# EAGLE design OV2640 (EAGLE 9.2.2)
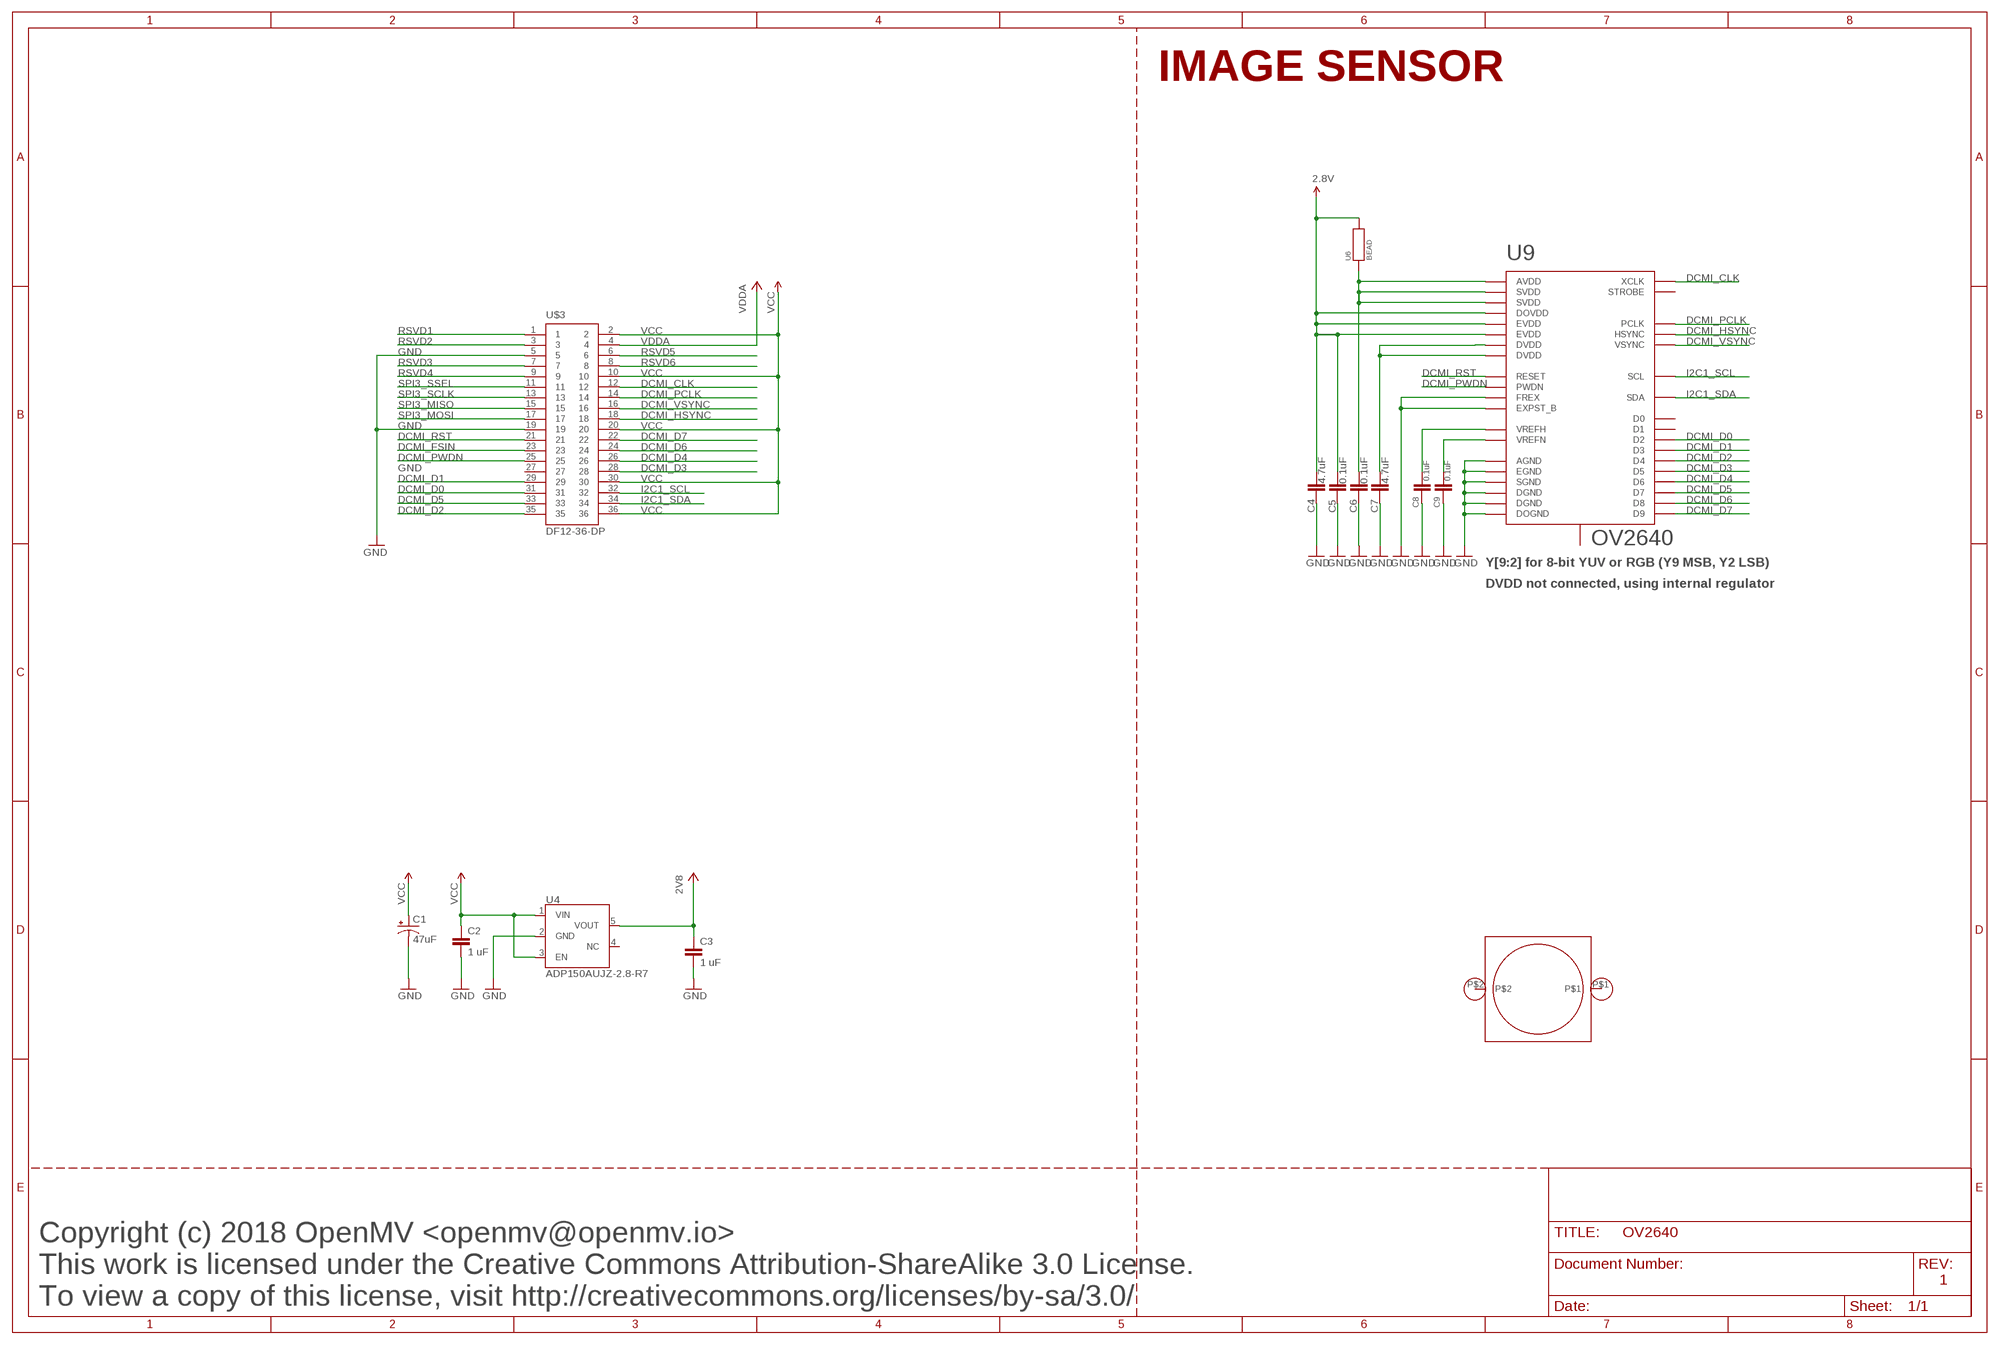
[diagram p0: schematic, sheet 1]

## Parts
C1  47uF  CAP_POL1206  [EIA3216]
C2  1 uF  CAP0402-CAP  [0402-CAP]
C3  1 uF  CAP0402-CAP  [0402-CAP]
C4  4.7uF  CAP0402-CAP  [0402-CAP]
C5  0.1uF  CAP0402-CAP  [0402-CAP]
C6  0.1uF  CAP0402-CAP  [0402-CAP]
C7  4.7uF  CAP0402-CAP  [0402-CAP]
C8  0.1uF  CAP0402-CAP  [0402-CAP]
C9  0.1uF  CAP0402-CAP  [0402-CAP]
LM1  LENSMOUNT20MM  [LENSMOUNT-20MM]
U4  ADP150AUJZ-2.8-R7  ADP150TSOT-5  [SOT23-5]
U6  BEAD  [0402-CAP]
U9  OV2640  [CSP2]
U$3  DF12-36-DP  [DF12-36-DP]

## Nets
2.8V: C4.1 C5.1 U6.2 U9.B1(DOVDD) U9.F1(EVDD) U9.G1(EVDD)
2V8: C3.1 U4.5(VOUT)
DCMI_CLK: U9.C4(XCLK) U$3.12
DCMI_D0: U9.F3(D2) U$3.31
DCMI_D1: U9.G3(D3) U$3.29
DCMI_D2: U9.F4(D4) U$3.35
DCMI_D3: U9.G4(D5) U$3.28
DCMI_D4: U9.E5(D6) U$3.26
DCMI_D5: U9.G5(D7) U$3.33
DCMI_D6: U9.F5(D8) U$3.24
DCMI_D7: U9.G6(D9) U$3.22
DCMI_FSIN: U$3.23
DCMI_HSYNC: U9.C3(HSYNC) U$3.18
DCMI_PCLK: U9.E3(PCLK) U$3.14
DCMI_PWDN: U9.B6(PWDN) U$3.25
DCMI_RST: U9.C6(RESET) U$3.21
DCMI_VSYNC: U9.D2(VSYNC) U$3.16
GND: C1.C(-) C2.2 C3.2 C4.2 C5.2 C6.2 C7.2 C8.2 C9.2 U4.2(GND) U9.A1(DOGND) U9.A2(EXPST_B) U9.A3(AGND) U9.A4(SGND) U9.B2(FREX) U9.E4(EGND) U9.E6(DGND) U9.G2(DGND) U$3.5 U$3.19
I2C1_SCL: U9.C2(SCL) U$3.32
I2C1_SDA: U9.C1(SDA) U$3.34
N$5: C8.1 U9.C5(VREFH)
N$6: C9.1 U9.A5(VREFN)
N$7: C7.1 U9.F2(DVDD) U9.F6(DVDD)
N$13: C6.1 U6.1 U9.B3(AVDD) U9.B4(SVDD) U9.B5(SVDD)
RSVD1: U$3.1
RSVD2: U$3.3
RSVD3: U$3.7
RSVD4: U$3.9
RSVD5: U$3.6
RSVD6: U$3.8
SPI3_MISO: U$3.15
SPI3_MOSI: U$3.17
SPI3_SCLK: U$3.13
SPI3_SSEL: U$3.11
VCC: C1.A(+) C2.1 U4.1(VIN) U4.3(EN) U$3.2 U$3.10 U$3.20 U$3.30 U$3.36
VDDA: U$3.4
Unconnected: LM1.P$1 LM1.P$2 U4.4(NC) U9.A6(STROBE) U9.D6(NC) U9.E1(D1) U9.E2(D0) U$3.27

## Notes on the sheet
- IMAGE SENSOR
- Y[9:2] for 8-bit YUV or RGB (Y9 MSB, Y2 LSB)
- DVDD not connected, using internal regulator
- Copyright (c) 2018 OpenMV <openmv@openmv.io>
- This work is licensed under the Creative Commons Attribution-ShareAlike 3.0 License.
- 1
- To view a copy of this license, visit http://creativecommons.org/licenses/by-sa/3.0/

## Library data of the parts
C1 = sfe:CAP_POL: Capacitor Polarized These are standard SMD and PTH capacitors. Normally 10uF, 47uF, and 100uF in electrolytic and tantalum varieties. Always verify the external diameter of the through hole cap, it varies with capacity, voltage, and manufacturer. The EIA devices should be standard.
C2 C3 = SparkFun-Capacitors:CAP: Capacitor Standard 0603 ceramic capacitor, and 0.1" leaded capacitor.
C4-C9 = sfe:CAP: Capacitor Standard 0603 ceramic capacitor, and 0.1" leaded capacitor.
LM1 = omnivision:LENSMOUNT
U4 = leptonCustom:ADP150: ADP150 2.8V 150mA Linear LDO Regulator Analog Devices ADP150AUJZ-2.8-R7
U6 = heka:BEAD
U9 = omnivision:OV2640
U$3 = DF12:DF12-36-DP

## Board
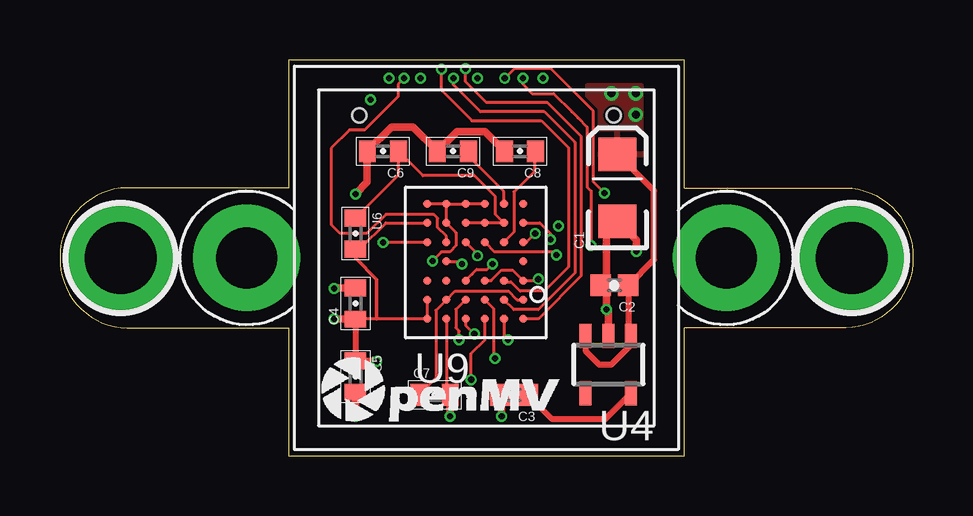
[diagram p1: board, top side]
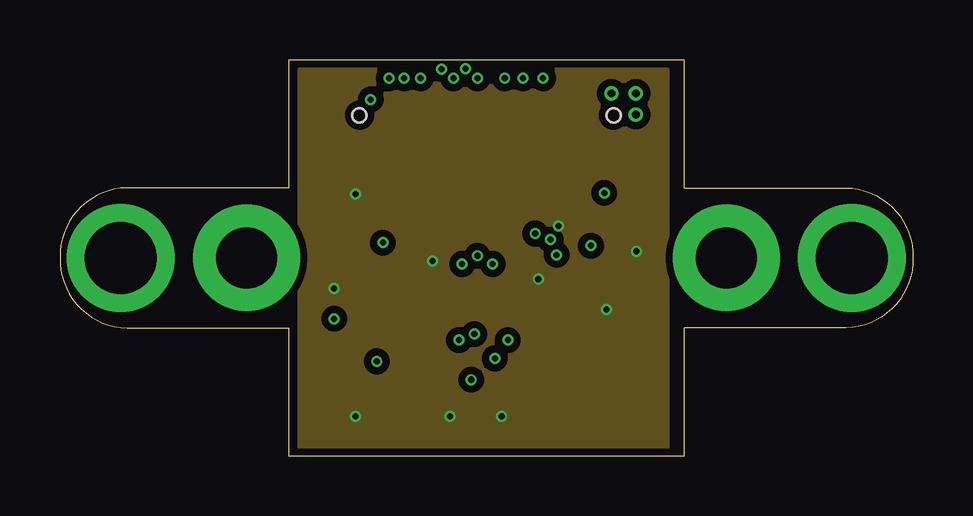
[diagram p2: board, inner layer GND]
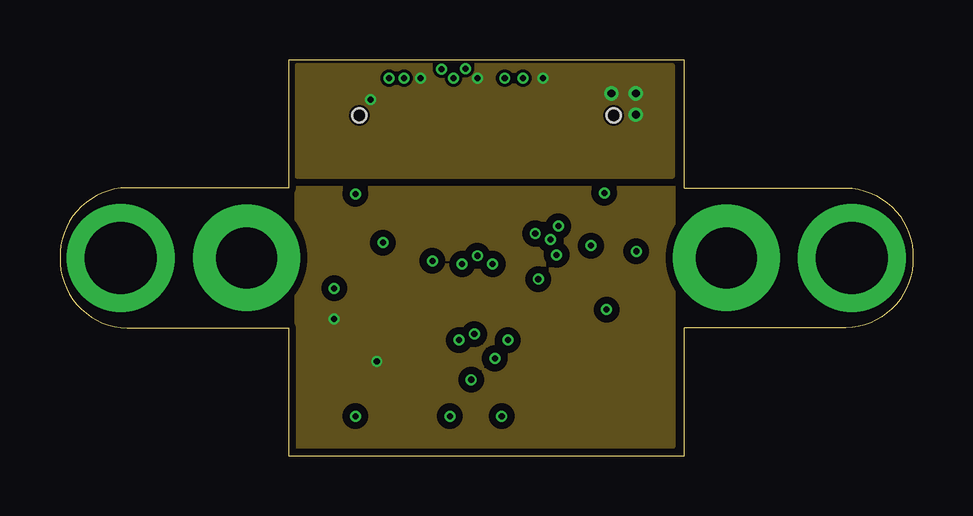
[diagram p3: board, inner layer VCC]
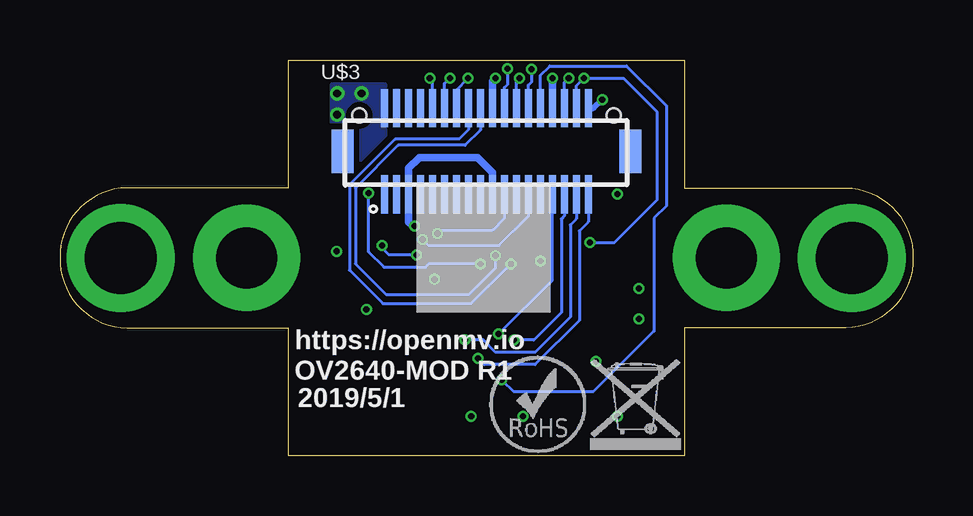
[diagram p4: board, bottom side, seen from below]

Size 35.56 x 16.51 mm. Coordinates in mm from the lower left corner, seen from the top.
Outline: 9.53,16.51 9.53,11.18 2.79,11.18 arc90 0,8.26 arc90 2.79,5.33 9.53,5.33 9.53,0 26.04,0 26.04,5.33 32.77,5.33 arc90 35.56,8.26 arc90 32.77,11.18 26.04,11.18 26.04,16.51 9.53,16.51
Copper layers (1*2+15*16): Top 0.035mm / dielectric 1.5mm / GND 0.035mm / dielectric 0.15mm / VCC 0.035mm / dielectric 0.2mm / Bottom 0.035mm
Design rules "default *": minimum track width 5mil, minimum drill 10mil, track to track 5mil, track to pad 5mil, pad to pad 5mil, via to via 5mil, smd to smd 5mil, copper to edge 5mil, drill to drill 10mil, minimum pad ring 10mil, minimum via ring 4mil, stop-mask expansion 2mil, vias tented up to drill 30mil, thermal gap 10mil

### Footprints (pad centres in the part's own frame; a part is rotated, then mirrored left to right if it is on the bottom)
EIA3216 = smd 1.4 x 1.6: A 1.4,0; C -1.4,0
0402-CAP = smd 0.85 x 0.9: 1 -0.58,0; 2 0.58,0
0402-CAP' = smd 0.7 x 0.9: 1 -0.65,0; 2 0.65,0
LENSMOUNT-20MM = drill 2.54 pad 4.445: P$1 -10,0; P$2 10,0
SOT23-5 = smd 0.5 x 1: 1 -0.95,-1.2; 2 0,-1.2; 3 0.95,-1.2; 4 0.95,1.2; 5 -0.95,1.2
CSP2 = smd 0.34 x 0.34: A1 -2,2.4; A2 -1.2,2.4; A3 -0.4,2.4; A4 0.4,2.4; A5 1.2,2.4; A6 2,2.4; B1 -2,1.6; B2 -1.2,1.6; B3 -0.4,1.6; B4 0.4,1.6; B5 1.2,1.6; B6 2,1.6; C1 -2,0.8; C2 -1.2,0.8; C3 -0.4,0.8; C4 0.4,0.8; C5 1.2,0.8; C6 2,0.8; D2 -1.2,0; D6 2,0; E1 -2,-0.8; E2 -1.2,-0.8; E3 -0.4,-0.8; E4 0.4,-0.8; E5 1.2,-0.8; E6 2,-0.8; F1 -2,-1.6; F2 -1.2,-1.6; F3 -0.4,-1.6; F4 0.4,-1.6; F5 1.2,-1.6; F6 2,-1.6; G1 -2,-2.4; G2 -1.2,-2.4; G3 -0.4,-2.4; G4 0.4,-2.4; G5 1.2,-2.4; G6 2,-2.4
DF12-36-DP = smd 0.3 x 1.6: 1 -4.25,-1.8; 2 -4.25,1.8; 3 -3.75,-1.8; 4 -3.75,1.8; 5 -3.25,-1.8; 6 -3.25,1.8; 7 -2.75,-1.8; 8 -2.75,1.8; 9 -2.25,-1.8; 10 -2.25,1.8; 11 -1.75,-1.8; 12 -1.75,1.8; 13 -1.25,-1.8; 14 -1.25,1.8; 15 -0.75,-1.8; 16 -0.75,1.8; 17 -0.25,-1.8; 18 -0.25,1.8; 19 0.25,-1.8; 20 0.25,1.8; 21 0.75,-1.8; 22 0.75,1.8; 23 1.25,-1.8; 24 1.25,1.8; 25 1.75,-1.8; 26 1.75,1.8; 27 2.25,-1.8; 28 2.25,1.8; 29 2.75,-1.8; 30 2.75,1.8; 31 3.25,-1.8; 32 3.25,1.8; 33 3.75,-1.8; 34 3.75,1.8; 35 4.25,-1.8; 36 4.25,1.8 | smd 0.9 x 1.8: F1 -6,0; F2 6,0 | hole 0.6: -5.3,1.5; 5.3,1.5

### Placement (x,y rotation side)
C1  23.24,11.18 90 top
C2  23.11,7.11 180 top
C3  18.92,2.54 180 top
C4  4.7uF  [0402-CAP']  12.32,6.35 90 top
C5  0.1uF  [0402-CAP']  12.32,3.3 270 top
C6  0.1uF  [0402-CAP']  13.46,12.7 180 top
C7  4.7uF  [0402-CAP']  15.62,2.54 0 top
C8  0.1uF  [0402-CAP']  19.18,12.7 180 top
C9  0.1uF  [0402-CAP']  16.38,12.7 180 top
LM1  17.78,8.26 0 top
U4  22.86,3.81 180 top
U6  BEAD  [0402-CAP']  12.32,9.27 270 top
U9  17.31,8.11 0 top
U$1  [WEEE]  13.46,0.25 0 bottom
U$2  [ROHS]  17.65,0.13 0 bottom
U$3  17.78,12.7 0 bottom
U$4  [OMV-LOGO-SMALL]  10.79,1.27 0 top

### Tracks (layer width: path | path; a pad name or v marks a point on that pad's centre or on a via)
2.8V  (via drill 0.25)
  Top 0.127: U9.F1 U9.G1 14.1,5.71 13.84,5.71 13.21,5.71 12.33,5.71 C4.1 | U6.2 12.5,8.62 13.59,9.71 U9.B1
  Top 0.152: U6.2 12.32,8.24 13.21,7.35 13.21,5.71
  Top 0.254: C4.1 C5.1
  Top 0.305: C4.1 v11.45,5.7 v11.43,5.71 | C5.1 12.33,3.94 v13.21,3.94
  pour VCC (isolate 0.305, rank 2): 9.91,0.38 9.91,11.3 25.53,11.3 25.53,0.38
2V8
  Top 0.254: C3.1 20.52,1.52 22.72,1.52 U4.5
DCMI_CLK  (via drill 0.25)
  Top 0.127: v19.3,15.75 19.3,15.49 19.69,15.11 20.57,15.11 21.34,14.35 21.59,14.1 21.97,13.72 21.97,11.21 22.14,11.05 v22.14,8.76 | U9.C4 18.11,8.51 20.57,8.51 v20.7,8.38
  Bottom 0.127: v19.3,15.75 19.53,15.52 U$3.12 | v20.7,8.38 21.84,8.38 22.14,8.67 v22.14,8.76
DCMI_D0  (via drill 0.25)
  Top 0.127: U9.F3 16.51,6.11 16.51,5.33 16.64,5.21 v16.64,4.83
  Bottom 0.127: U$3.31 14.53,10.01 14.66,9.88 14.66,5.97 15.8,4.83 v16.64,4.83
DCMI_D1  (via drill 0.25)
  Top 0.127: U9.G3 16.91,5.44 v17.27,5.08
  Bottom 0.127: v17.27,5.08 15.03,7.32 U$3.29
DCMI_D2  (via drill 0.25)
  Top 0.127: U9.F4 17.95,6.27 18.07,6.15 18.07,4.12 v18.13,4.06
  Bottom 0.127: U$3.35 13.53,9.76 13.91,9.38 13.91,5.65 15.75,3.81 17.88,3.81 v18.13,4.06
DCMI_D3  (via drill 0.25)
  Top 0.127: U9.G4 17.71,4.83 17.14,4.26 v17.14,3.17
  Bottom 0.127: U$3.28 15.53,15.86 15.14,16.26 11.94,16.26 10.29,14.61 10.29,10.41 10.79,9.91 10.79,8.76 10.79,5.21 13.34,2.67 16.64,2.67 v17.14,3.17
DCMI_D4  (via drill 0.25)
  Top 0.127: v15.9,16.13 15.9,15.24 17.17,13.97 20.07,13.97 21.21,12.83 21.21,9.02 21.21,7.89 20.19,6.87 19.18,6.87 18.8,7.25 18.57,7.25 U9.E5
  Bottom 0.127: v15.9,16.13 15.9,15.59 16.03,15.47 U$3.26
DCMI_D5  (via drill 0.25)
  Top 0.127: U9.G5 18.51,4.99 v18.67,4.83
  Bottom 0.127: U$3.33 14.03,9.88 14.28,9.63 14.28,5.78 15.75,4.32 17.4,4.32 17.91,4.83 v18.67,4.83
DCMI_D6  (via drill 0.25)
  Top 0.127: U9.F5 18.92,6.1 19.94,6.1 21.46,7.62 21.46,13.08 20.19,14.35 17.53,14.35 16.4,15.47 v16.4,15.75
  Bottom 0.127: U$3.24 16.53,15.62 v16.4,15.75
DCMI_D7  (via drill 0.25)
  Top 0.127: U9.G6 19.94,5.71 21.72,7.49 21.72,13.34 20.32,14.73 17.78,14.73 16.9,15.61 v16.9,16.14
  Bottom 0.127: v16.9,16.14 16.9,15.48 17.03,15.36 U$3.22
DCMI_HSYNC  (via drill 0.25)
  Top 0.127: U9.C3 17.4,8.42 v17.4,8.34
  Bottom 0.127: U$3.18 18.03,13.59 18.67,12.95 21.46,12.95 23.24,11.18 23.24,8 22.54,7.3 21.97,6.73 18.5,6.73 17.4,7.84 v17.4,8.34
DCMI_PCLK  (via drill 0.25)
  Top 0.127: U9.E3 17.18,7.58 17.37,7.77 17.81,7.77 v18.03,8 | v18.54,15.75 18.96,16.17 20.45,16.17 22.23,14.39 22.23,11.43 v22.69,10.96
  Bottom 0.127: U$3.14 19.03,15.26 v18.54,15.75 | v22.69,10.96 22.69,8.51 22.06,7.87 20.32,7.87 20.19,8 v18.03,8
DCMI_PWDN  (via drill 0.25)
  Top 0.127: U9.B6 20.01,9.71 20.45,9.27 v20.45,9.02
  Bottom 0.127: U$3.25 16.03,10.01 17.27,8.76 20.19,8.76 v20.45,9.02
DCMI_RST  (via drill 0.25)
  Top 0.127: v19.81,9.27 19.45,8.91 U9.C6
  Bottom 0.127: U$3.21 17.03,9.91 17.54,9.4 19.69,9.4 v19.81,9.27
DCMI_VSYNC  (via drill 0.25)
  Top 0.127: U9.D2 16.66,8.11 v16.76,8
  Bottom 0.127: U$3.16 18.53,13.6 18.92,13.21 21.59,13.21 23.5,11.3 23.5,7.75 22.1,6.35 18.41,6.35 v16.76,8
GND  (via drill 0.25)
  Top 0.127: U9.G2 16.11,2.7 C7.2 | v11.45,7 v11.43,6.99 | C2.2 22.53,6.99 22.79,7.24 22.79,7.11 v22.79,6.1 | U9.E4 17.98,7.31 18.41,7.75 18.87,7.75 U9.E6 19.88,7.31 v19.94,7.37 | U9.A4 U9.A3 U9.A2 | U9.A2 U9.B2 16.51,9.31 16.51,8.76 16.26,8.51 15.91,8.51 v15.52,8.13 | U9.A2 U9.A1
  Top 0.305: U4.2 22.86,6.02 v22.79,6.1 22.79,6.86 C2.2 | 22.79,7.11 22.79,9.32 C1.C 24.02,8.99 v24.02,8.53 | C3.2 18.41,2.47 v18.41,1.65 | C7.2 16.26,2.52 v16.26,1.65 | C5.2 v12.32,1.65 | C4.2 v11.45,7 | v12.32,10.92 12.81,11.41 C6.2 13.83,13.72 14.72,13.72 C9.2 16.55,13.52 17.71,13.52 C8.2
  Bottom 0.305: v20.78,9.58 20.85,9.58 21.03,9.76 U$3.5 21.03,11.99 20.57,12.45 18.16,12.45 17.53,11.81 U$3.19
  pour GND (isolate 0.305): 10.03,0.13 10.03,16.13 25.27,16.13 25.27,0.13
I2C1_SCL  (via drill 0.25)
  Top 0.127: U9.C2 16.11,9.16 15.75,9.53 15.75,9.91 15.58,10.07 13.59,10.07 12.79,9.27 11.68,9.27 11.3,9.65 11.3,12.83 12.07,13.59 12.7,13.59 14.1,14.99 14.1,15.49 v14.35,15.75
  Bottom 0.127: U$3.32 14.53,15.57 v14.35,15.75
I2C1_SDA  (via drill 0.25)
  Top 0.127: U9.C1 15.29,8.89 v13.46,8.89
  Bottom 0.127: U$3.34 14.03,15.43 v13.72,15.75 12.07,15.75 10.67,14.35 10.67,10.67 12.45,8.89 v13.46,8.89
N$2  (via drill 3 pad 4.5)
  other vias: 2.54,8.26
N$4  (via drill 3 pad 4.5)
  other vias: 33.02,8.26
N$5
  Top 0.127: U9.C5 18.92,9.32 18.92,11 19.78,11.86 19.78,12.65 C8.1
N$6
  Top 0.127: U9.A5 18.51,11.02 17.03,12.49 C9.1
N$7
  Top 0.127: U9.F6 19.06,6.51 18.7,6.87 16.47,6.87 U9.F2 15.67,6.07 15.67,3.24 C7.1
N$13
  Top 0.127: U9.B3 U9.B4 U9.B5 18.15,10.07 18.15,10.81 17.27,11.68 15.13,11.68 C6.1 14.11,11.71 U6.1
VCC  (via drill 0.25, 0.33)
  Top 0.254: C1.A 24.77,11.05 24.77,8.18 C2.1 23.69,5.13 U4.1 23.81,4.63 22.99,3.81 22.48,3.81 21.91,4.38 U4.3
  Bottom 0.127: U$3.10 20.03,15.64 v20.14,15.75
  Bottom 0.254: U$3.36 13.31,14.5 v12.95,14.86
  Bottom 0.305: U$3.30 v15.03,15.75 | U$3.20 17.53,15.62 v17.4,15.75
  other vias: 24,15.11 22.99,15.11 24,14.22
  pour Bottom (isolate 0.254, rank 2, no thermals): 21.97,15.49 24.26,15.49 24.26,12.06 21.97,12.06
  pour Top: 21.97,15.49 24.26,15.49 24.26,11.94 21.97,11.94
  pour VCC: 9.91,11.68 25.53,11.68 25.53,16.26 9.91,16.26
VDDA
  pour Bottom (isolate 0.254, no thermals): 21.08,15.24 21.72,15.24 21.72,13.84 21.08,13.84

### Text on the board
bPlace: https://openmv.io | OV2640-MOD R1 | 2019/5/1